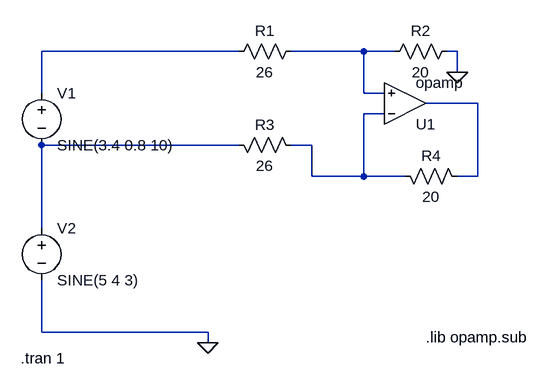
[diagram p0: schematic Differential measure.asc]
Differential measure.asc, the LTspice schematic file:
Version 4
SHEET 1 880 680
WIRE 0 -112 -304 -112
WIRE 192 -112 80 -112
WIRE 240 -112 192 -112
WIRE 336 -112 320 -112
WIRE 336 -80 336 -112
WIRE -304 -48 -304 -112
WIRE 192 -48 192 -112
WIRE 224 -48 192 -48
WIRE 368 -32 288 -32
WIRE 224 -16 192 -16
WIRE 0 32 -304 32
WIRE 112 32 80 32
WIRE 112 80 112 32
WIRE 192 80 192 -16
WIRE 192 80 112 80
WIRE 256 80 192 80
WIRE 368 80 368 -32
WIRE 368 80 336 80
WIRE -304 160 -304 32
WIRE -304 320 -304 240
WIRE -48 320 -304 320
WIRE -48 336 -48 320
FLAG -48 336 0
FLAG 336 -80 0
SYMBOL Opamps\\opamp 256 32 M180
SYMATTR InstName U1
SYMBOL res -16 -96 R270
WINDOW 0 32 56 VTop 0
WINDOW 3 0 56 VBottom 0
SYMATTR InstName R1
SYMATTR Value 26
SYMBOL res 224 -96 R270
WINDOW 0 32 56 VTop 0
WINDOW 3 0 56 VBottom 0
SYMATTR InstName R2
SYMATTR Value 20
SYMBOL res 96 48 M270
WINDOW 0 32 56 VTop 0
WINDOW 3 0 56 VBottom 0
SYMATTR InstName R3
SYMATTR Value 26
SYMBOL res 352 96 M270
WINDOW 0 32 56 VTop 0
WINDOW 3 0 56 VBottom 0
SYMATTR InstName R4
SYMATTR Value 20
SYMBOL voltage -304 -64 R0
WINDOW 123 0 0 Left 0
WINDOW 39 0 0 Left 0
SYMATTR InstName V1
SYMATTR Value SINE(3.4 0.8 10)
SYMBOL voltage -304 144 R0
WINDOW 123 0 0 Left 0
WINDOW 39 0 0 Left 0
SYMATTR InstName V2
SYMATTR Value SINE(5 4 3)
TEXT 288 328 Left 0 !.lib opamp.sub
TEXT -336 360 Left 0 !.tran 1

The netlist it stands for:
* Differential measure.asc
XU1 N004 N002 N003 opamp Aol=100K GBW=10Meg  ; pins invin noninvin out
R1 N001 N002 26
R2 N002 0 20
R3 N004 N005 26
R4 N003 N004 20
V1 N001 N005 SINE(3.4 0.8 10)
V2 N005 0 SINE(5 4 3)
.lib opamp.sub
.tran 1
.backanno
.end